# Altium project imu_digital.PrjPcb
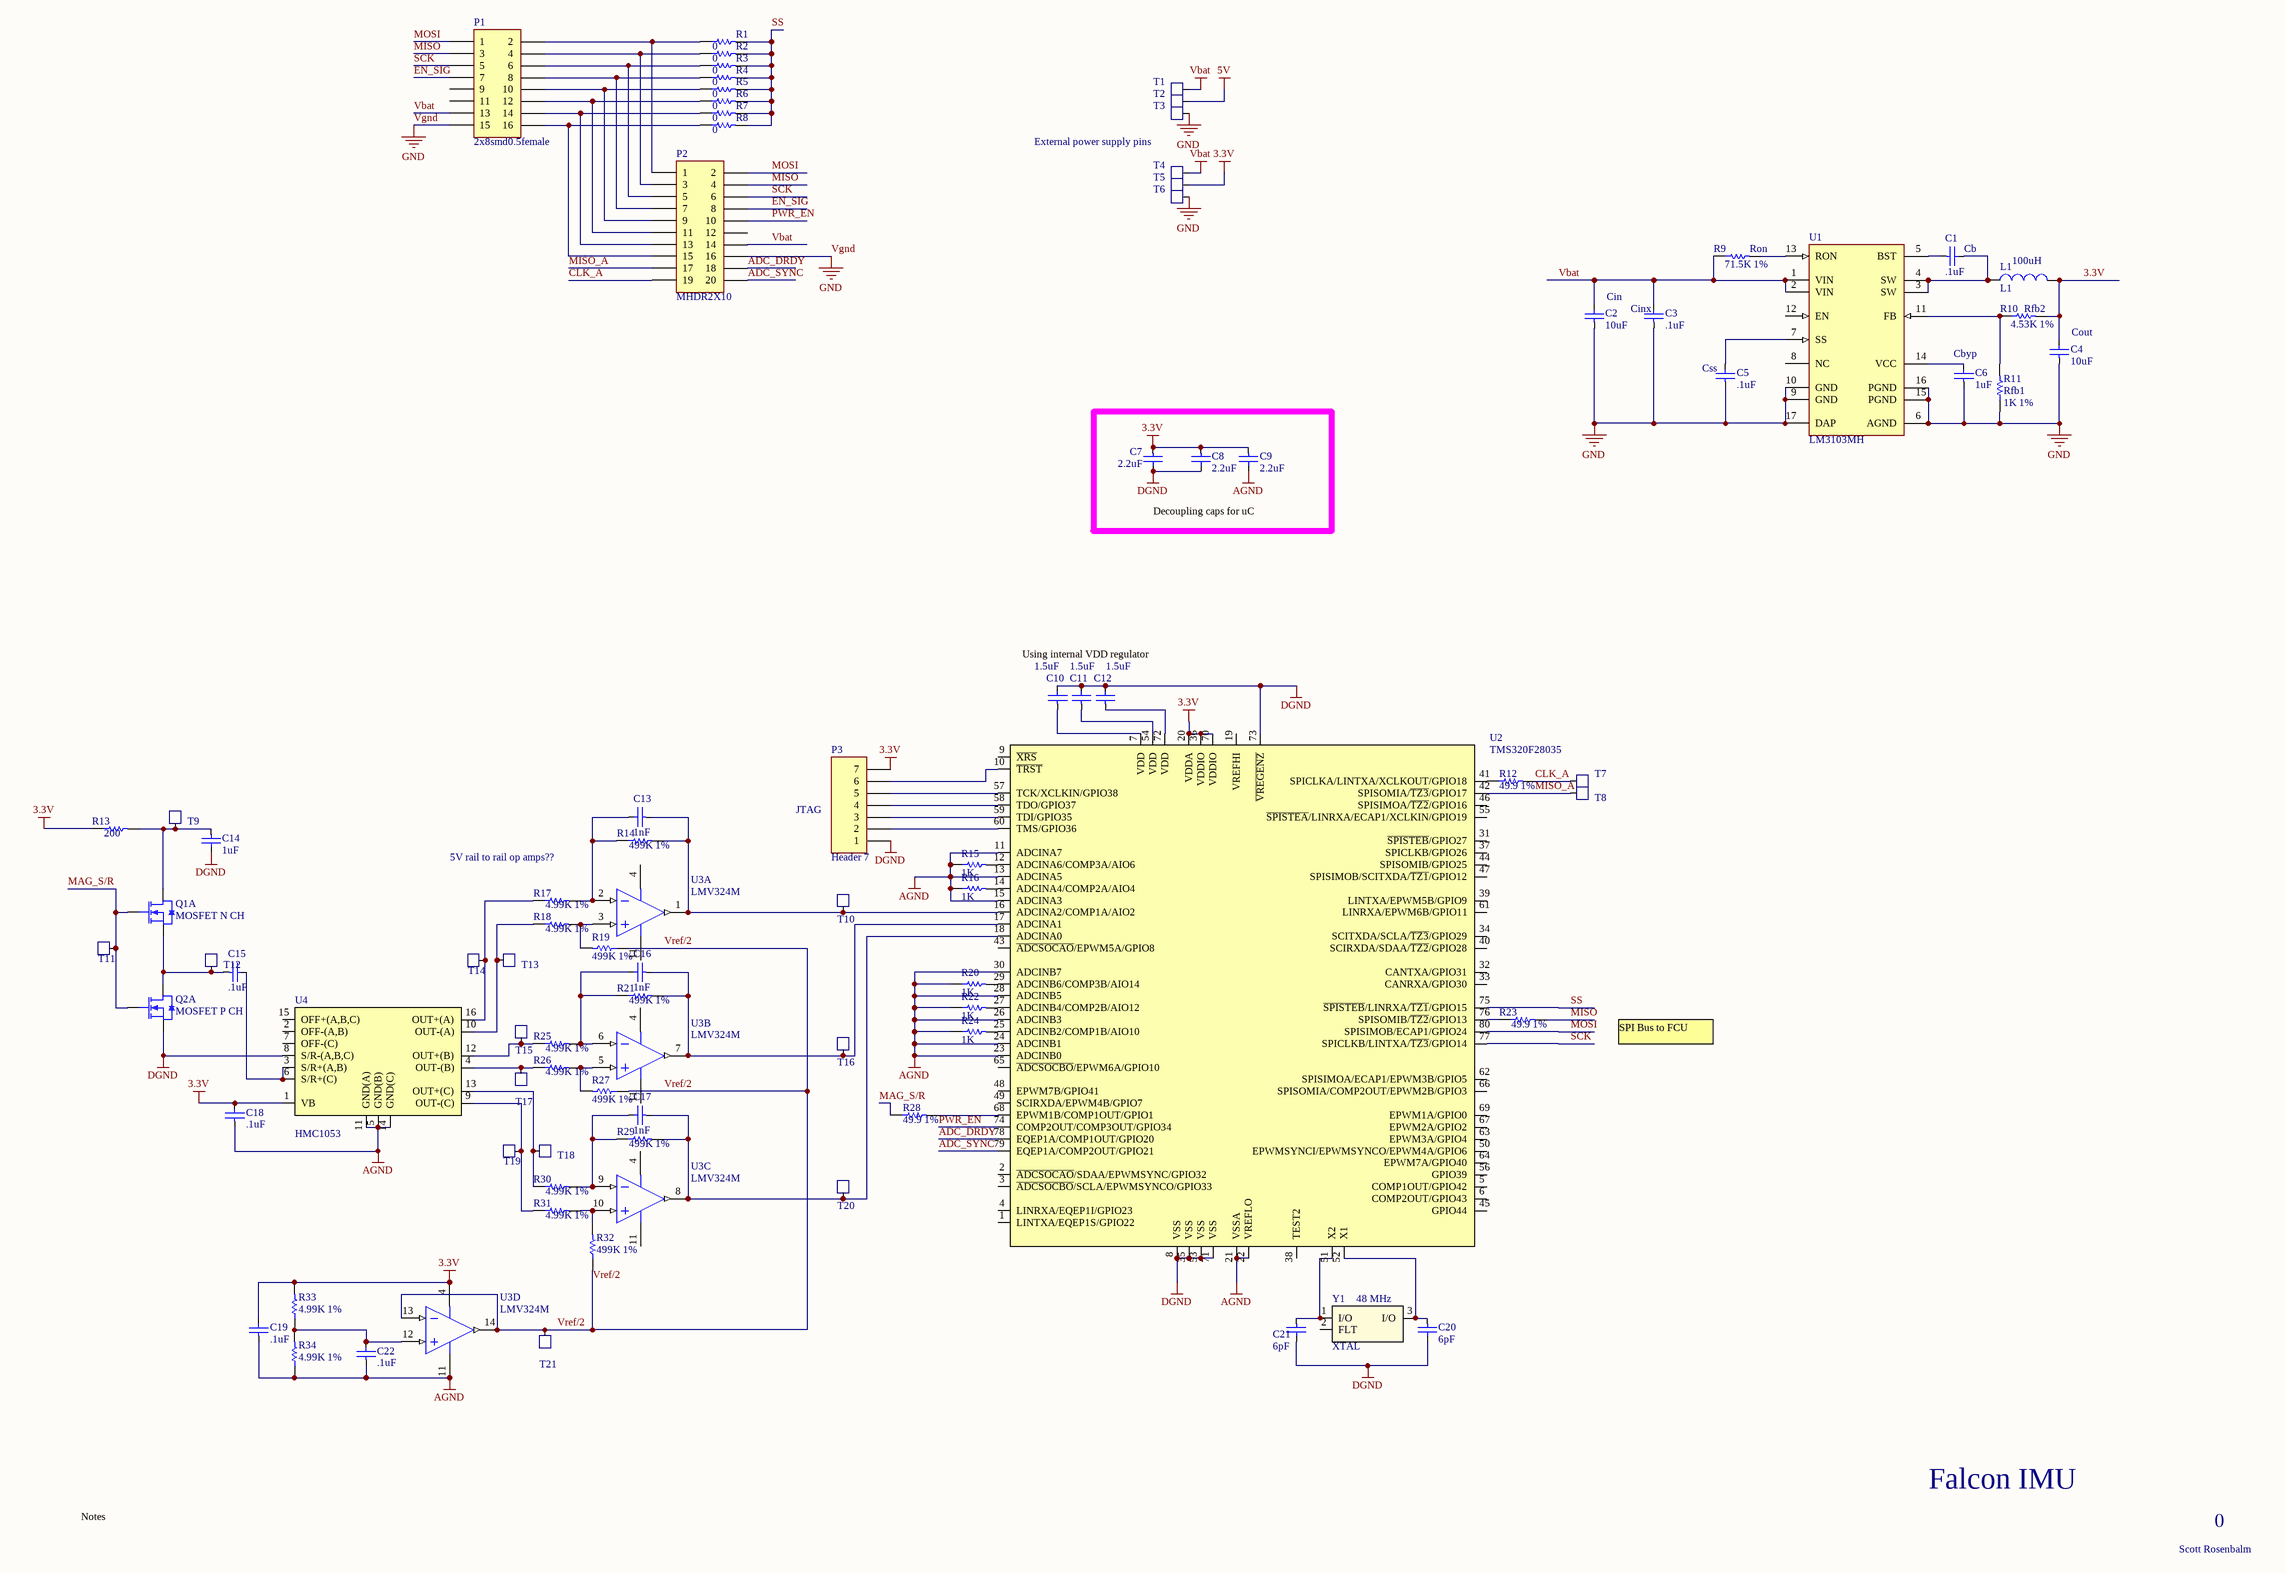
[diagram p0: imu_digital.SchDoc]
1 sheet, 88 parts. Net scope: global (net labels, ports and power ports of the same name join across sheets).
Board file: imu_digital.PcbDoc

## Sheet imu_digital.SchDoc
size C; PageSetup: Record=PageOptions|CenterHorizontal=True|CenterVertical=True|PrintScale=0.62|XCorrection=1.00|YCorrection=1.00|PrintKind=1|BorderSize=5000000|LeftOffset=0|BottomOffset=0|Orientation=2|PaperLength=1000|PaperWidth=1000|Scale=100|PaperSource=7|PrintQuality=-4|MediaType=1|DitherType=10|PaperKind=Letter|PrintScaleMode=0

### Parts
C1  Cb  value .1uF  [0603 (1608)]
C2  Cin  value 10uF  [1210 (3225)]
C3  Cinx  value .1uF  [0603 (1608)]
C4  Cout  value 10uF  [1206 (3216)]
C5  Css  value .1uF  [0603 (1608)]
C6  Cbyp  value 1uF  [0603 (1608)]
C7  value 2.2uF  [0603 (1608)]  (hidden comment: Capacitor)
C8  value 2.2uF  [0603 (1608)]  (hidden comment: Capacitor)
C9  value 2.2uF  [0603 (1608)]  (hidden comment: Capacitor)
C10  1.5uF  [0805 (2012)]
C11  1.5uF  [0805 (2012)]
C12  1.5uF  [0805 (2012)]
C13  1nF  [0603 (1608)]
C14  1uF  [0603 (1608)]
C15  value .1uF  [0603 (1608)]  (hidden comment: Capacitor)
C16  1nF  [0603 (1608)]
C17  1nF  [0603 (1608)]
C18  value .1uF  [0603 (1608)]  (hidden comment: Capacitor)
C19  value .1uF  [0603 (1608)]  (hidden comment: Capacitor)
C20  6pF  [0603 (1608)]
C21  6pF  [0603 (1608)]
C22  value .1uF  [0603 (1608)]  (hidden comment: Capacitor)
L1  L1  value 100uH  [Inductor Footprint]
P1  2x8smd0.5female  [S9007E-08-ND]
P2  MHDR2X10  [S9013E-10-ND]
P3  Header 7  [HDR1X7]
Q1  MOSFET N CH  [SOT563F]  (part A of 2)
Q2  MOSFET P CH  [SOT563F]  (part A of 2)
R1  value 0  [0603 (1608)]  (hidden comment: Res1)
R2  value 0  [0603 (1608)]  (hidden comment: Res1)
R3  value 0  [0603 (1608)]  (hidden comment: Res1)
R4  value 0  [0603 (1608)]  (hidden comment: Res1)
R5  value 0  [0603 (1608)]  (hidden comment: Res1)
R6  value 0  [0603 (1608)]  (hidden comment: Res1)
R7  value 0  [0603 (1608)]  (hidden comment: Res1)
R8  value 0  [0603 (1608)]  (hidden comment: Res1)
R9  Ron  value 71.5K 1%  [0603 (1608)]
R10  Rfb2  value 4.53K 1%  [0603 (1608)]
R11  Rfb1  value 1K 1%  [0603 (1608)]
R12  value 49.9 1%  [0603 (1608)]  (hidden comment: 931 1%)
R13  200  [0603 (1608)]
R14  499K 1%  [0603 (1608)]
R15  1K  [0603 (1608)]
R16  1K  [0603 (1608)]
R17  value 4.99K 1%  [0603 (1608)]  (hidden comment: Res1)
R18  value 4.99K 1%  [0603 (1608)]  (hidden comment: Res1)
R19  499K 1%  [0603 (1608)]
R20  1K  [0603 (1608)]
R21  499K 1%  [0603 (1608)]
R22  1K  [0603 (1608)]
R23  value 49.9 1%  [0603 (1608)]  (hidden comment: 931 1%)
R24  1K  [0603 (1608)]
R25  value 4.99K 1%  [0603 (1608)]  (hidden comment: Res1)
R26  value 4.99K 1%  [0603 (1608)]  (hidden comment: Res1)
R27  499K 1%  [0603 (1608)]
R28  value 49.9 1%  [0603 (1608)]  (hidden comment: 931 1%)
R29  499K 1%  [0603 (1608)]
R30  value 4.99K 1%  [0603 (1608)]  (hidden comment: Res1)
R31  value 4.99K 1%  [0603 (1608)]  (hidden comment: Res1)
R32  499K 1%  [0603 (1608)]
R33  value 4.99K 1%  [0603 (1608)]  (hidden comment: Res1)
R34  value 4.99K 1%  [0603 (1608)]  (hidden comment: Res1)
T1  TEST_PAD  [TEST_PAD]  (value not drawn)
T2  TEST_PAD  [TEST_PAD]  (value not drawn)
T3  TEST_PAD  [TEST_PAD]  (value not drawn)
T4  TEST_PAD  [TEST_PAD]  (value not drawn)
T5  TEST_PAD  [TEST_PAD]  (value not drawn)
T6  TEST_PAD  [TEST_PAD]  (value not drawn)
T7  (no value)  [TEST_PAD]
T8  (no value)  [TEST_PAD]
T9  (no value)  [TEST_PAD]
T10  (no value)  [TEST_PAD]
T11  (no value)  [TEST_PAD]
T12  (no value)  [TEST_PAD]
T13  (no value)  [TEST_PAD]
T14  (no value)  [TEST_PAD]
T15  (no value)  [TEST_PAD]
T16  (no value)  [TEST_PAD]
T17  (no value)  [TEST_PAD]
T18  (no value)  [TEST_PAD]
T19  (no value)  [TEST_PAD]
T20  (no value)  [TEST_PAD]
T21  (no value)  [TEST_PAD]
U1  LM3103MH  [MXA16A_N]
U2  TMS320F28035  [TS-PQFP-G80]
U3  LMV324M  [M14A_N]  (parts A,B,C,D of 4)
U4  HMC1053  [LCC-16]
Y1  XTAL  Frequency: 48 MHz  [Murata XTAL]

### Blocks framed on the sheet
Decoupling caps for uC: C7-C9

### Nets
3.3V: C4.1 C7.2 C8.2 C9.2 C18.1 C19.1 L1.2 P3.7 R10.2 R13.1 R33.2 T5.0 U2.20(VDDA) U2.36(VDDIO) U2.70(VDDIO) U3.4(V+) U4.1(VB)
5V: T2.0
AGND: C9.1 C18.2 C19.2 C22.2 R15.1 R16.1 R20.1 R22.1 R24.1 R34.1 U2.11(ADCINA7) U2.13(ADCINA5) U2.15(ADCINA3) U2.21(VSSA) U2.22(VREFLO) U2.23(ADCINB0) U2.24(ADCINB1) U2.26(ADCINB3) U2.28(ADCINB5) U2.30(ADCINB7) U3.11(V-) U4.5(GND(B)) U4.11(GND(A)) U4.14(GND(C))
DGND: C7.1 C8.1 C10.1 C11.1 C12.1 C14.1 C20.1 C21.1 P3.1 Q2.1(S1) U2.8(VSS) U2.35(VSS) U2.53(VSS) U2.71(VSS) U2.73(~{VREGENZ}) U4.8(S/R-(A,B,C))
Vbat: C2.1 C3.1 P1.13 P2.14 R9.1 T1.0 T4.0 U1.1(VIN) U1.2(VIN)
Vgnd: C2.2 C3.2 C4.2 C5.2 C6.2 P1.15 P2.16 R11.1 T3.0 T6.0 U1.6(AGND) U1.9(GND) U1.10(GND) U1.15(PGND) U1.16(PGND) U1.17(DAP)  [also labelled GND]
ADC_DRDY: P2.18 U2.78(EQEP1A/COMP1OUT/GPIO20)
ADC_SYNC: P2.20 U2.79(EQEP1A/COMP2OUT/GPIO21)
CLK_A: P2.19 R12.2 T7.0
EN_SIG: P1.7 P2.8
MAG_S/R: Q1.2(G1) Q2.2(G1) R28.1 T11.0
MISO: P1.3 P2.4 R23.2
MISO_A: P2.17 T8.0 U2.42(SPISOMIA/~{TZ3}/GPIO17)
MOSI: P1.1 P2.2 U2.80(SPISIMOB/ECAP1/GPIO24)
PWR_EN: P2.10 U2.74(COMP2OUT/COMP3OUT/GPIO34)
SCK: P1.5 P2.6 U2.77(SPICLKB/LINTXA/~{TZ3}/GPIO14)
SS: R1.2 R2.2 R3.2 R4.2 R5.2 R6.2 R7.2 R8.2 U2.75(~{SPISTEB}/LINRXA/~{TZ1}/GPIO15)
Vref/2: R19.1 R27.1 R32.1 T21.0 U3.13(IND-) U3.14(OUTD)
NetC1_1: C1.1 L1.1 U1.3(SW) U1.4(SW)
NetC1_2: C1.2 U1.5(BST)
NetC5_1: C5.1 U1.7(SS)
NetC6_1: C6.1 U1.14(VCC)
NetC10_2: C10.2 U2.7(VDD)
NetC11_2: C11.2 U2.54(VDD)
NetC12_2: C12.2 U2.72(VDD)
NetC13_1: C13.1 R14.1 R17.2 U3.2(INA-)
NetC13_2: C13.2 R14.2 T10.0 U2.16(ADCINA2/COMP1A/AIO2) U3.1(OUTA)
NetC14_2: C14.2 Q1.6(D1) R13.2 T9.0
NetC15_1: C15.1 U4.3(S/R+(A,B)) U4.6(S/R+(C))
NetC15_2: C15.2 Q1.1(S1) Q2.6(D1) T12.0
NetC16_1: C16.1 R21.1 R25.2 U3.6(INB-)
NetC16_2: C16.2 R21.2 T16.0 U2.17(ADCINA1) U3.7(OUTB)
NetC17_1: C17.1 R29.1 R30.2 U3.9(INC-)
NetC17_2: C17.2 R29.2 T20.0 U2.18(ADCINA0) U3.8(OUTC)
NetC20_2: C20.2 U2.52(X1) Y1.3(I/O)
NetC21_2: C21.2 U2.51(X2) Y1.1(I/O)
NetC22_1: C22.1 R33.1 R34.2 U3.12(IND+)
NetP1_2: P1.2 P2.1 R1.1
NetP1_4: P1.4 P2.3 R2.1
NetP1_6: P1.6 P2.5 R3.1
NetP1_8: P1.8 P2.7 R4.1
NetP1_10: P1.10 P2.9 R5.1
NetP1_12: P1.12 P2.11 R6.1
NetP1_14: P1.14 P2.13 R7.1
NetP1_16: P1.16 P2.15 R8.1
NetP3_2: P3.2 U2.60(TMS/GPIO36)
NetP3_3: P3.3 U2.59(TDI/GPIO35)
NetP3_4: P3.4 U2.58(TDO/GPIO37)
NetP3_5: P3.5 U2.57(TCK/XCLKIN/GPIO38)
NetP3_6: P3.6 U2.10(~{TRST})
NetR9_2: R9.2 U1.13(RON)
NetR10_1: R10.1 R11.2 U1.11(FB)
NetR12_1: R12.1 U2.41(SPICLKA/LINTXA/XCLKOUT/GPIO18)
NetR15_2: R15.2 U2.12(ADCINA6/COMP3A/AIO6)
NetR16_2: R16.2 U2.14(ADCINA4/COMP2A/AIO4)
NetR17_1: R17.1 T14.0 U4.16(OUT+(A))
NetR18_1: R18.1 T13.0 U4.10(OUT-(A))
NetR18_2: R18.2 R19.2 U3.3(INA+)
NetR20_2: R20.2 U2.29(ADCINB6/COMP3B/AIO14)
NetR22_2: R22.2 U2.27(ADCINB4/COMP2B/AIO12)
NetR23_1: R23.1 U2.76(SPISOMIB/~{TZ2}/GPIO13)
NetR24_2: R24.2 U2.25(ADCINB2/COMP1B/AIO10)
NetR25_1: R25.1 T15.0 U4.12(OUT+(B))
NetR26_1: R26.1 T17.0 U4.4(OUT-(B))
NetR26_2: R26.2 R27.2 U3.5(INB+)
NetR28_2: R28.2 U2.68(EPWM1B/COMP1OUT/GPIO1)
NetR30_1: R30.1 T18.0 U4.13(OUT+(C))
NetR31_1: R31.1 T19.0 U4.9(OUT-(C))
NetR31_2: R31.2 R32.2 U3.10(INC+)

Not connected (* = marked no-connect by the designer): P1 9 11; P2 12; U1 8(NC) 12(EN); U2 1(LINTXA/EQEP1S/GPIO22) 2(~{ADCSOCAO}/SDAA/EPWMSYNC/GPIO32) 3(~{ADCSOCBO}/SCLA/EPWMSYNCO/GPIO33) 4(LINRXA/EQEP1I/GPIO23) 5(COMP1OUT/GPIO42) 6(COMP2OUT/GPIO43) 9(~{XRS}) 19(VREFHI) 31(~{SPISTEB}/GPIO27) 32(CANTXA/GPIO31) 33(CANRXA/GPIO30) 34(SCITXDA/SCLA/~{TZ3}/GPIO29) 37(SPICLKB/GPIO26) 38(TEST2) 39(LINTXA/EPWM5B/GPIO9) 40(SCIRXDA/SDAA/~{TZ2}/GPIO28) 43(~{ADCSOCAO}/EPWM5A/GPIO8) 44(SPISOMIB/GPIO25) 45(GPIO44) 46(SPISIMOA/~{TZ2}/GPIO16) 47(SPISIMOB/SCITXDA/~{TZ1}/GPIO12) 48(EPWM7B/GPIO41) 49(SCIRXDA/EPWM4B/GPIO7) 50(EPWMSYNCI/EPWMSYNCO/EPWM4A/GPIO6) 55(~{SPISTEA}/LINRXA/ECAP1/XCLKIN/GPIO19) 56(GPIO39) 61(LINRXA/EPWM6B/GPIO11) 62(SPISIMOA/ECAP1/EPWM3B/GPIO5) 63(EPWM3A/GPIO4) 64(EPWM7A/GPIO40) 65(~{ADCSOCBO}/EPWM6A/GPIO10) 66(SPISOMIA/COMP2OUT/EPWM2B/GPIO3) 67(EPWM2A/GPIO2) 69(EPWM1A/GPIO0); U4 2(OFF-(A,B)) 7(OFF-(C)) 15(OFF+(A,B,C)); Y1 2(FLT)

### Notes on the sheet
- External power supply pins
- Using internal VDD regulator
- JTAG
- 5V rail to rail op amps??
- SPI Bus to FCU
- Falcon IMU
- Notes to self:
  Tie VREGENZ low, use internal 1.8V ref for uC VDD.
  uC ADC -> use internal 3.3V reference.
  Use TDM mode, fixed position data on ads1178.
  The differential opamps provide an active low-pass filter. Look at http://focus.ti.com/lit/an/sloa064a/sloa064a.pdf for more info on active filters with differential op amps.
  I believe with a feedback cap of 56nF, the -3dB frequency will be 2.7kHz, which will be acceptable for all our sensors. ADXRS620 reccomends a filter at the desired BW and at 5X the desired BW, to cut down on the 14kHz noise created by the modulation in the sensor. The passive low-pass at the output of the sensor provides a 500Hz filter, while the active filter provides the 2.5kHz filter recommended.
- Main Questions/Concerns:
  1. Switching power supply or linear regulator?
  Linear drop from 16.4V to 3.3V with 120mA of current is about 1.5W. sensors are somewhat temperature sensitive...
  Switching regulator:
  PROS: a lot less heat than linear.
  CONS: More power noise. Simulation said 0.2 mV ripple, not bad. more components/board space.
  - switching at same frequency as oscillator for ADC (1MHz). Bad?
  2. Does differential op amp provide ANY benifit when all the inputs are single ended anyway? Do I need ANY op amp? can I just feed 'raw' signals into ADC?
  3. Different ground planes? Not sure the best way to do that.
  4. App note for magnetometer HMC1053 says to apply Vref/2 to the non-inverting terminal of the op amps. I had an extra opamp available, so I used it to buffer the Vref/2 from a voltage divider. Is this a good idea, or should I use a different method? (see opamp directly under HMC1053).
  5. magnetometer has a Set/Reset functionality that demagnetizes the sensor periodically. It shoots around 500mA of current from a holding cap into the sensor, then pulls it out the other way. (This is the MOSFET pair thing). Should I put the Set/Reset stuff on DGND, while the rest of the sensor is on AGND? Is that possible/helpful?
  6. This is a little more nitty gritty, but concerning the ADC... The VREFP input should be 2.5V (just half of the AVDD i think). The appnote shows using another (ti) opamp and (ti) zener diode reference to supply the voltage to VREFP. But, the adc has a VCOM output, which is supposed to be AVDD/2 anyway, AND i am already using an opamp to buffer that output, so shouldn't I just route that back into VREFP?
- Scott Rosenbalm
- 0

### Library data of the parts
C1 C3 C5 C15 C18 C19 C22 = Capacitor: Manufacturer: Murata; Part No.: 490-1524-1-ND; Vendor: Digikey; Price Est.: $0.019
C2 = Capacitor: COG Ceramic Cap -> near input to ads1178; Part No.: 810-C3225X7R1E106M; Vendor: Mouser; ESR: Low ESR; Price Est.: $1.07
C4 = Capacitor: COG Ceramic Cap -> near input to ads1178; Part No.: 810-C3216X5R1A106M; Vendor: Mouser; ESR: Low ESR; Price Est.: $0.31
C6 = Capacitor: COG Ceramic Cap -> near input to ads1178; Part No.: 810-C1608Y5V1A105Z; Vendor: Mouser; ESR: Low ESR; Price Est.: $0.04
C7-C9 = Capacitor: Manufacturer: TDK; Part No.: 445-5167-1-ND; Vendor: Digikey; Tolerance: 20%; Price Est.: $0.121
C10-C12 = Capacitor: Manufacturer: Murata; Part No.: 490-1740-1-ND; Vendor: Digikey; Price Est.: $0.202; Value: 1.5uF
C13 C16 C17 = Capacitor: Manufacturer: Murata; Part No.: 490-1451-1-ND; Vendor: Digikey; Tolerance: 5%; Price Est.: $0.043; Value: 1nF
C14 = Capacitor: Manufacturer: Murata; Part No.: 81-GRM188R61E105KA12; Vendor: Mouser; Tolerance: 10%; Voltage: 25V; Price Est.: $0.08; Value: 1uF
C20 C21 = Capacitor: Manufacturer: TDK; Part No.: 445-5036-1-ND; Vendor: Digikey; Tolerance: .25pF; Special: COG; Price Est.: $0.044; Value: 6pF
L1 = Inductor: Part No.: SDR0604-101KLCT-ND; Price Est.: $0.46
P1 = 2x8smd0.5female: Vendor: Digikey; Part No.: S9007E-08-ND; Price Est.: 1.43
P2 = MHDR2X10: Header, 10-Pin, Dual row, Male; Vendor: Digikey; Part No.: S9013E-10-ND; Price Est.: $1.80
P3 = Header 7: Header, 7-Pin; LatestRevisionDate: 17-Jul-2002; LatestRevisionNote: Re-released for DXP Platform.; Publisher: Altium Limited
Q1 Q2 = MOSFETs: Part No.: SI1035X-T1-E3CT-ND; Manufacturer: Vishay Siliconx; Vendor: Digikey; Price Est.: $0.59
R1-R8 = Res1: Resistor; Published: 8-Jun-2000; LatestRevisionDate: 17-Jul-2002; LatestRevisionNote: Re-released for DXP Platform.; PackageReference: AXIAL-0.3; Publisher: Altium Limited
R9 = Res1: Resistor; Part No.: P71.5KHCT-ND; Vendor: Digikey; Price Est.: $0.04
R10 = Res1: Resistor; Part No.: RMCF0603FT4K53CT-ND; Vendor: Digikey; Price Est.: $0.04
R11 = Res1: Resistor; Part No.: P1.00KHCT-ND; Vendor: Digikey; Price Est.: $0.04
R12 R23 R28 = Res1: Resistor; Part No.: P49.9HCT-ND; Vendor: Digikey; Price Est.: $0.04
R13 = Res1: Resistor; Part No.: P200GCT-ND; Vendor: Digikey; Value: 200; Price Est.: $0.03
R14 R19 R21 R27 R29 R32 = Res1: Resistor; Part No.: P499KHCT-ND; Vendor: Digikey; Value: 499K 1%; Price Est.: $0.04
R15 R16 R20 R22 R24 = Res1: Resistor; Part No.: P1.0KGCT-ND; Vendor: Digikey; Estimated Cost: $0.03; Tolerance: 5%; Value: 1K
R17 R18 R25 R26 R30 R31 R33 R34 = Res1: Resistor; Part No.: P4.99KHCT-ND; Vendor: Digikey; Price Est.: $0.04
T7-T21 = TEST_PAD
U1 = LM3103MH: Synchronous 1MHz 0.75A Step-Down Voltage  Regulator; Manufacturer: National Semiconductor; CompType: Switcher; PackageTopMarking: NSUZXYTT*LM3103*MH; PowerWise: Y; FirstPublished: 4-Dec-2008; DatasheetVersion: Oct-2007; PackageVersion: revA, Apr-2003; PackageReference: MXA16A; Publisher: Altium Limited; PackageDescription: Molded TSSOP, Jedec, Exposed Pad, 5.0 x 4.4 x 0.9mm Body,16 Lead, 0.65mm Pitch; PartNumber: LM3103MH; RoHS: Y; PinCount: 16; DigiKeyPartNumber: LM3103MH-ND; Code_JEDEC: MO-153-ABT; ComponentLink1Description: LM3103 Datasheet; ComponentLink1URL: http://www.national.com/ds/LM/LM3103.pdf; ComponentLink2Description: LM3103 Web Page; ComponentLink2URL: http://www.national.com/pf/LM/LM3103.html; ComponentLink3Description: MXA16A Package Page; ComponentLink3URL: http://www.national.com/packaging/folders/mxa16a.html
U2 = TMS320F28035 (80-pin): 80-pin; Manufacturer: Texas Instruments; Part No.: TMS320F28035PNS-ND; Vendor: Digikey; Price Est.: $15
U3 = LMV324M: General Purpose, Low Voltage, Rail-to-Rail Output Operational Amplifiers; Manufacturer: National Semiconductor; PackageTopMarking: NSUZXYTT*LMV324M; PowerWise: N; Published: 4-Dec-2008; LatestRevisionDate: 13-Jan-2009; LatestRevisionNote: Sim Model Added.; DatasheetVersion: Oct-2007; PackageVersion: revJ, Jan-1996; PackageReference: M14A; Publisher: Altium Limited; PackageDescription: Molded Package S.O., .150in Wide, 14 Lead; CompType: Amplifiers; PartNumber: LMV324M; RoHS: O; PinCount: 14; DigiKeyPartNumber: LMV324MXCT-ND; Code_JEDEC: MS-012AB; Code_IPC: SOIC127P600-14; ComponentLink1Description: LMV324 Datasheet; ComponentLink1URL: http://www.national.com/ds/LM/LMV324.pdf; ComponentLink2Description: LMV324 Web Page; ComponentLink2URL: http://www.national.com/pf/LM/LMV324.html; ComponentLink3Description: M14A Package Page; ComponentLink3URL: http://www.national.com/packaging/folders/m14a.html
Y1 = XTAL: Part No.: 490-5588-1-ND; Vendor: Digikey; Price Est.: $0.80